# EAGLE board boron-v1.00 (EAGLE 9.1.0), part 1 of 2
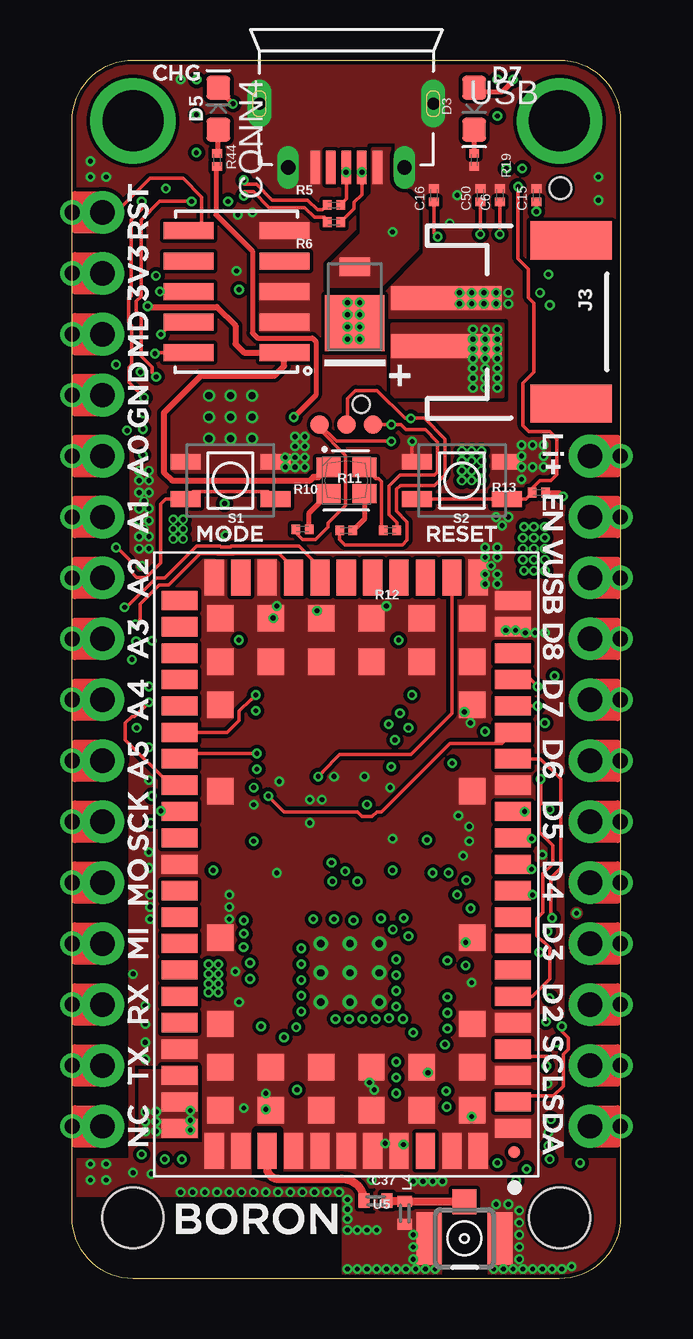
[diagram p2: board, top side]
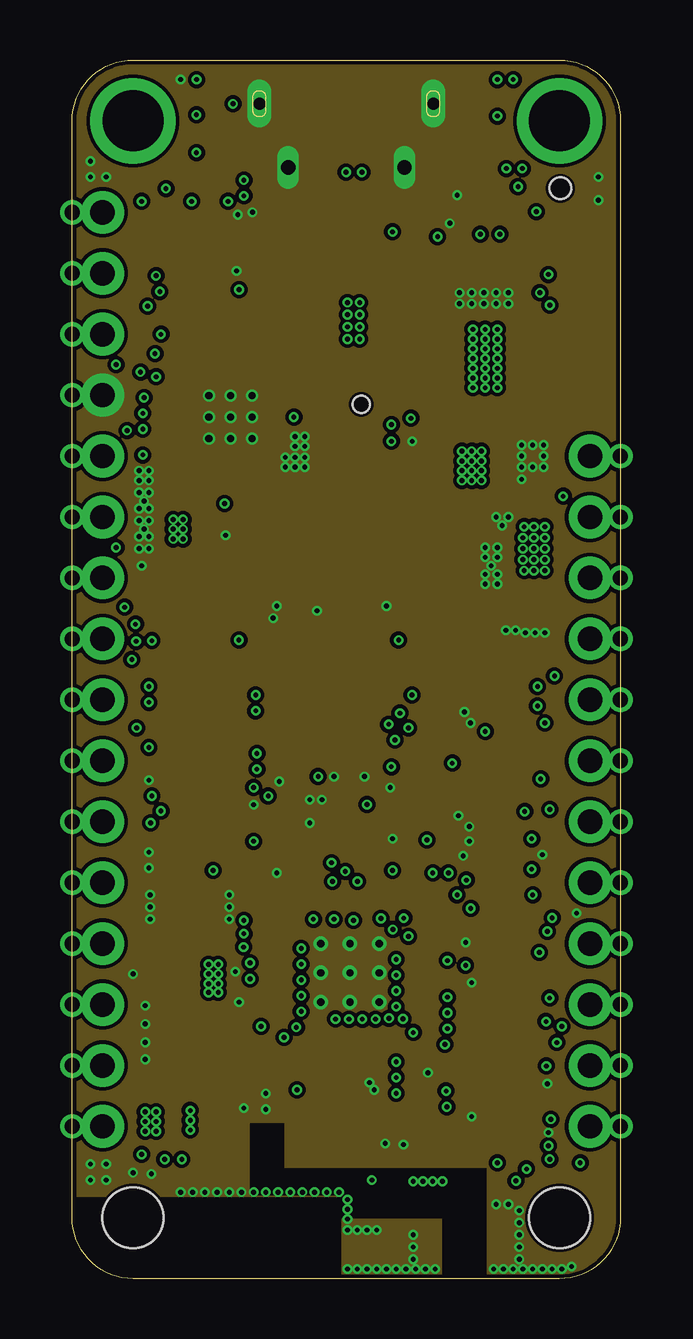
[diagram p3: board, inner layer Layer2-gnd]
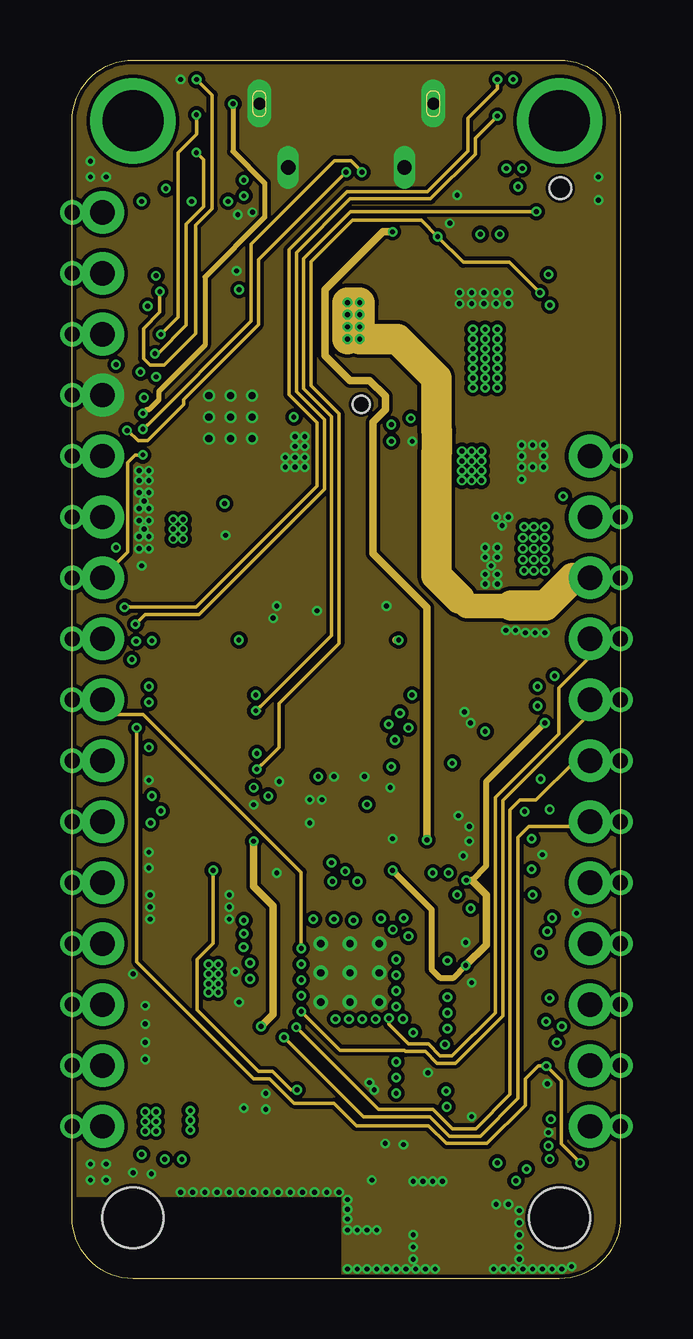
[diagram p4: board, inner layer Layer3-signal]
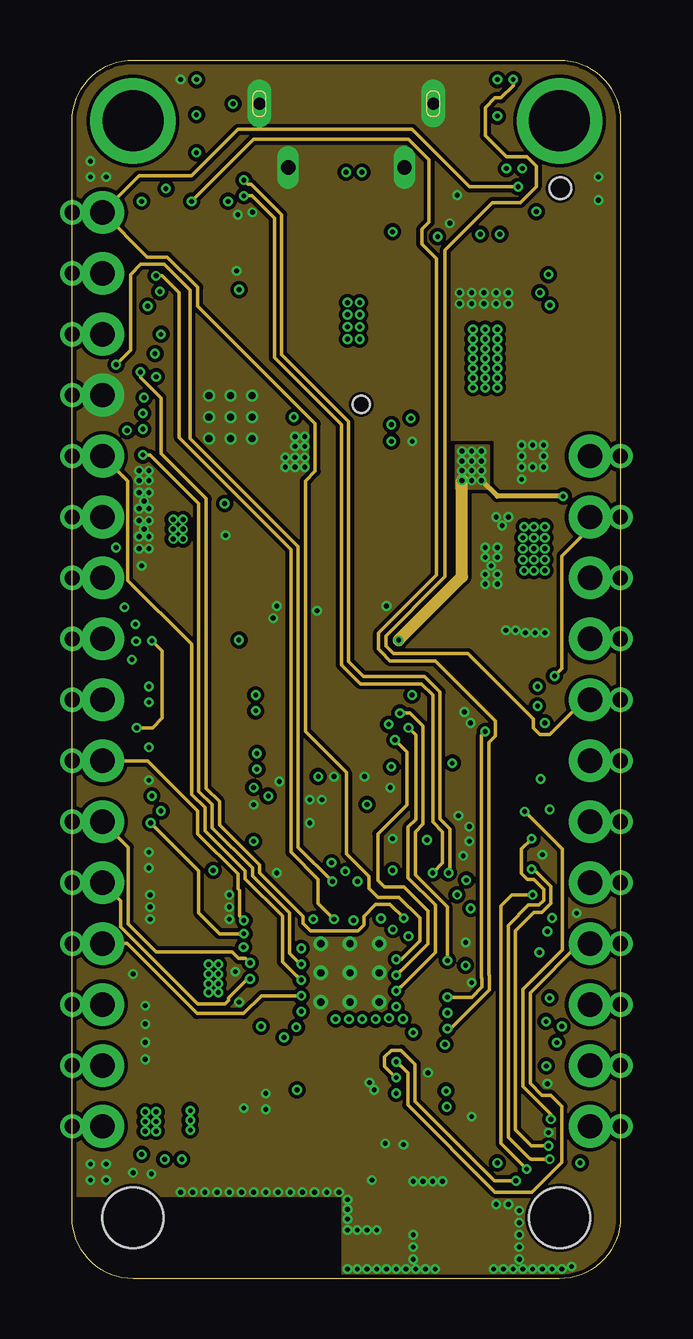
[diagram p5: board, inner layer Layer4-signal]
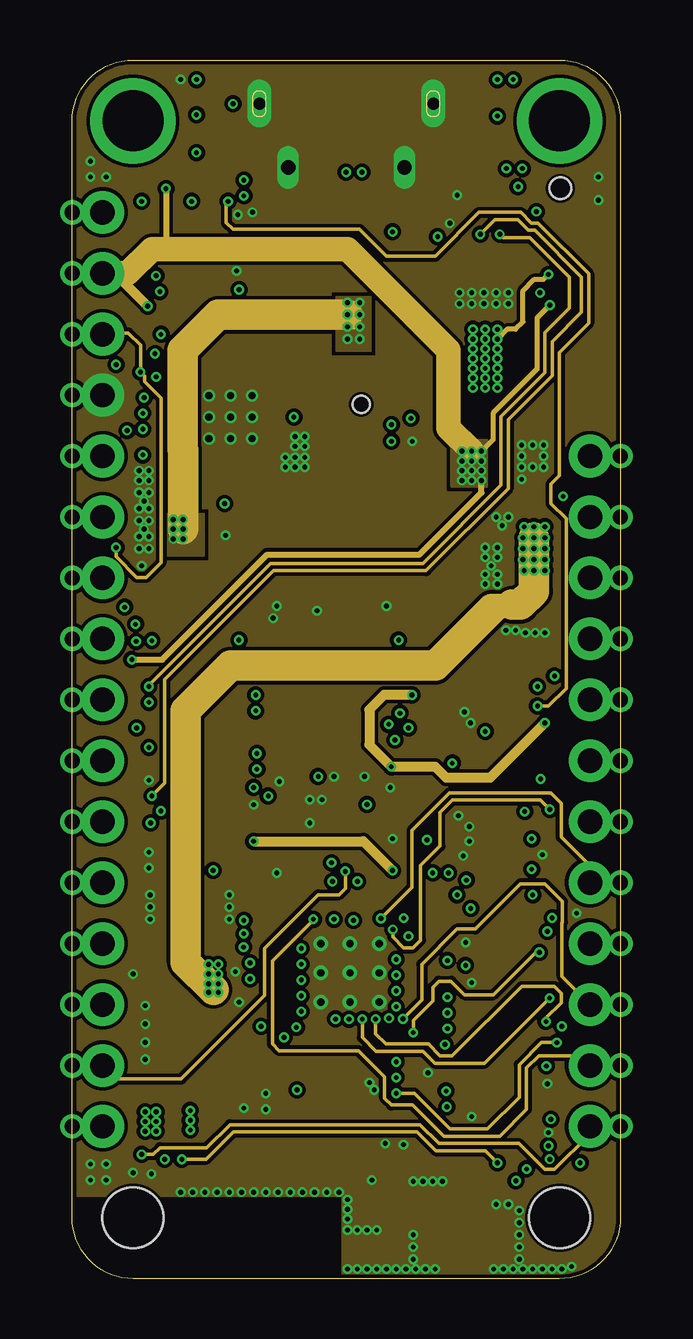
[diagram p6: board, inner layer Layer5-signal]
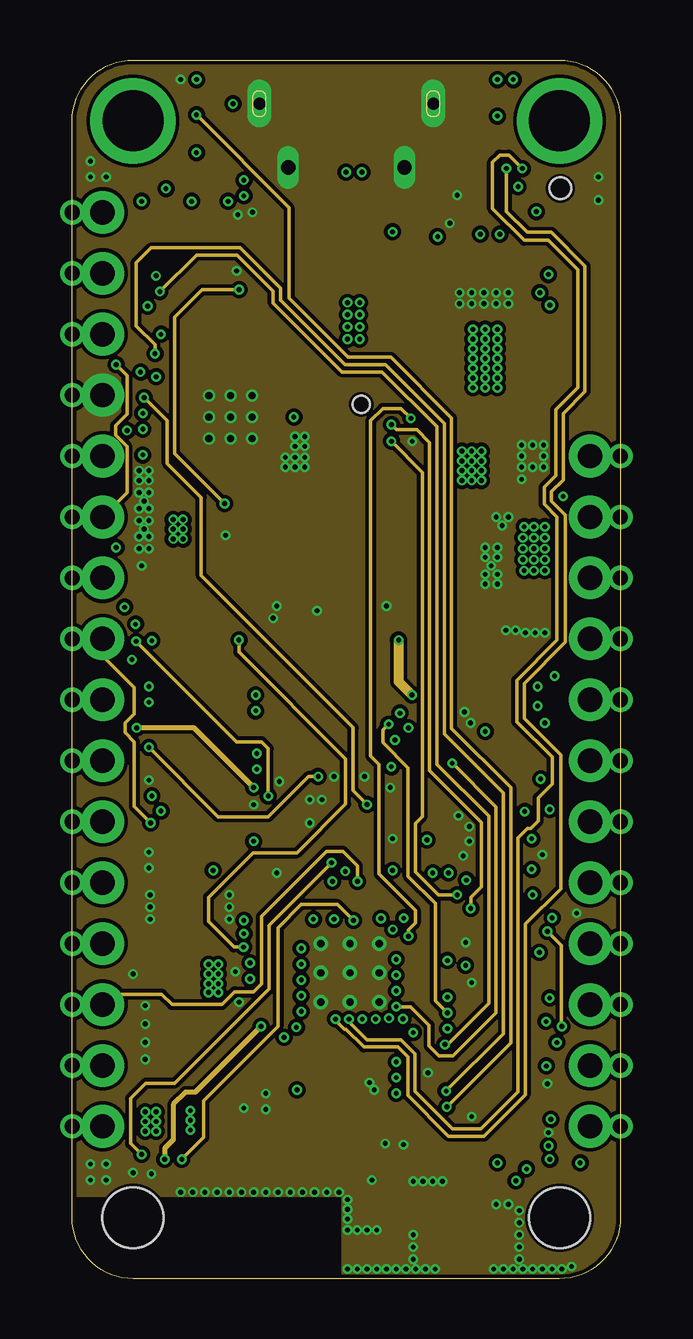
[diagram p7: board, inner layer Layer6-signal]
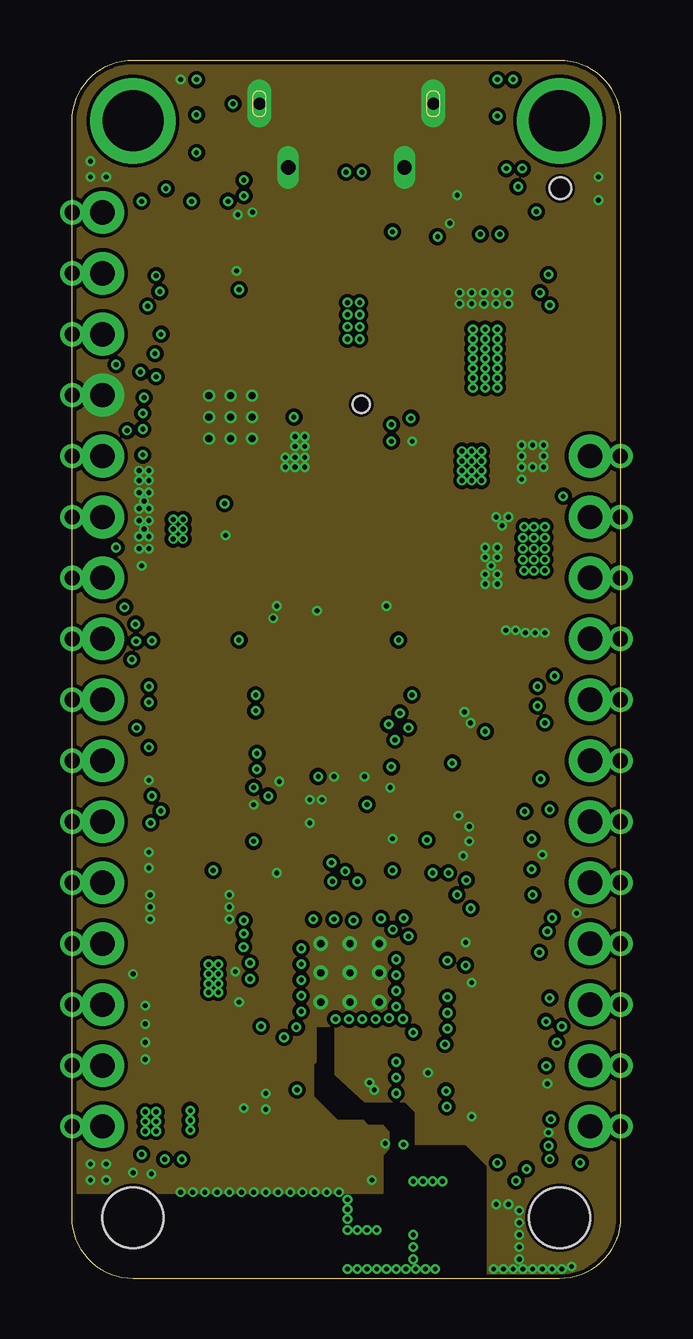
[diagram p8: board, inner layer Layer7-gnd]
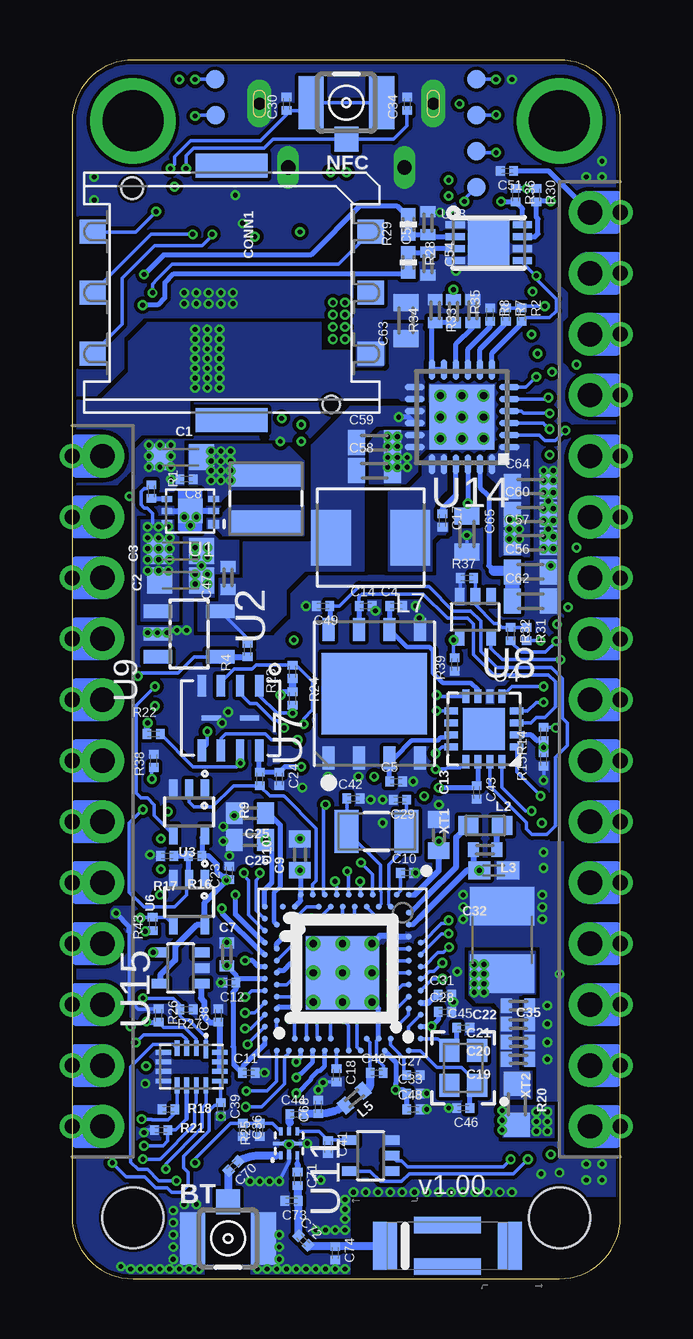
[diagram p9: board, bottom side, seen from below]

Size 22.86 x 50.8 mm. Coordinates in mm from the lower left corner, seen from the top.
Outline: 22.86,48.26 22.86,2.54 arc-90 20.32,0 2.54,0 arc-90 0,2.54 0,48.26 arc-90 2.54,50.8 20.32,50.8 arc-90 22.86,48.26
Copper layers (1+2+3+4+5+6+7+16): Top 0.018mm / dielectric 0.195mm / Layer2-gnd 0.035mm / dielectric 1.1mm / Layer3-signal 0.035mm / dielectric 0.2mm / Layer4-signal 0.035mm / dielectric 0.15mm / Layer5-signal 0.035mm / dielectric 0.2mm / Layer6-signal 0.035mm / dielectric 0.15mm / Layer7-gnd 0.035mm / dielectric 0.2mm / Bottom 0.018mm
Design rules "spark-4layer *": minimum track width 4mil, minimum drill 0.2mm, track to track 6mil, track to pad 6mil, pad to pad 6mil, via to via 6mil, smd to smd 0mil, copper to edge 6mil, drill to drill 6mil, minimum pad ring 4mil, minimum via ring 4mil, stop-mask expansion 0.01mm, vias tented up to drill 16mil, thermal gap 4mil
Net classes: 0 default: width 0.152 mm, clearance 0.152 mm; 2 RF: width 0.33 mm, clearance 0.191 mm; 3 BAT: clearance 0.203 mm; 6 +3V3: width 0.152 mm, clearance 0.152 mm
Holes 2.54 mm at 20.32,2.54 2.54,2.54
tKeepout: 5 lines
tRestrict: area 0,-0.1 to 11.2,3.4; area 15.4,0 to 17.3,2.9; area 20.7,14.9 to 21.4,15.6; 14 lines
bRestrict: area 0,-0.1 to 11.2,3.4; area 15.4,0 to 17.3,2.9; area 8.8,6.8 to 10.9,11.1; 37 lines

## Footprints (pad centres in the part's own frame; a part is rotated, then mirrored left to right if it is on the bottom)
AT5020 = smd 1 x 2: 1 2.6,0; 3 -2.6,0 | smd 2.8 x 0.7: 2 0,0.865; 4 0,-0.865
C0603K = smd 1.05 x 1.08: 1 -0.875,0; 2 0.875,0
C0201_B = smd 0.356 x 0.406: 1 -0.279,0; 2 0.279,0
C0402_B = smd 0.457 x 0.61: 1 -0.483,0; 2 0.483,0
C0402 = smd 0.7 x 0.9: 1 -0.65,0; 2 0.65,0
C0402K = smd 0.925 x 0.74: 1 -0.6,0; 2 0.6,0
C1210 = smd 1.6 x 2.7: 1 -1.4,0; 2 1.4,0
C0603_B = smd 0.711 x 1.041: 1 -0.749,0; 2 0.749,0
GCT-SIM8100 = smd 1 x 1.1: C1 2.54,-5.8; C2 0,-5.8; C3 -2.54,-5.8; C5 2.54,5.8; C6 0,5.8; C7 -2.54,5.8 | smd 1 x 3: NC@1 -5.3,0; NC@2 5.3,0 | hole 0.7: 4.65,4.15 | hole 0.9: -4.35,-4.15
1X12-CASTELLATED = drill 1.016 pad 1.778: 1 0,-13.97; 2 0,-11.43; 3 0,-8.89; 4 0,-6.35; 5 0,-3.81; 6 0,-1.27; 7 0,1.27; 8 0,3.81; 9 0,6.35; 10 0,8.89; 11 0,11.43; 12 0,13.97 | drill 0.635 pad 1.016: @1 1.27,-13.97; @2 1.27,-11.43; @3 1.27,-8.89; @4 1.27,-6.35; @5 1.27,-3.81; @6 1.27,-1.27; @7 1.27,1.27; @8 1.27,3.81; @9 1.27,6.35; @10 1.27,8.89; @11 1.27,11.43; @12 1.27,13.97
CONN5X2_1.27 = smd 0.7 x 2.1: 1 -2.54,-2; 2 -2.54,2; 3 -1.27,-2; 4 -1.27,2; 5 0,-2; 6 0,2; 7 1.27,-2; 8 1.27,2; 9 2.54,-2; 10 2.54,2
1X16-CASTELLATED = drill 1.016 pad 1.778: 1 0,-19.05; 2 0,-16.51; 3 0,-13.97; 4 0,-11.43; 5 0,-8.89; 6 0,-6.35; 7 0,-3.81; 8 0,-1.27; 9 0,1.27; 10 0,3.81; 11 0,6.35; 12 0,8.89; 13 0,11.43; 14 0,13.97; 15 0,16.51; 16 0,19.05 | drill 0.635 pad 1.016: @1 1.27,-19.05; @2 1.27,-16.51; @3 1.27,-13.97; @4 1.27,-11.43; @5 1.27,-8.89; @6 1.27,-6.35; @7 1.27,-3.81; @8 1.27,-1.27; @9 1.27,1.27; @10 1.27,3.81; @11 1.27,6.35; @12 1.27,8.89; @13 1.27,11.43; @14 1.27,13.97; @15 1.27,16.51; @16 1.27,19.05
LED-0603 = smd 1 x 1: A -0.877,0; C 0.877,0
DIODE-DO-220AA_NT(SMP) = smd 0.762 x 1.27: ANODE 2.349,0 | smd 2.337 x 2.464: CATHODE 0,0
JST-2-SMD@2 = smd 1 x 4.6: 1 -1,-3.7; 2 1,-3.7 | smd 1.6 x 3.4: NC1 -3.4,1.5; NC2 3.4,1.5
INDUCTOR-VLS-E = smd 1 x 3: P$1 -1,0; P$2 1,0
RESC0603_L = smd 0.85 x 0.8: 1 -0.7,0; 2 0.7,0
INDUCTOR-4040 = smd 1.65 x 2.3: P$1 -1.65,0; P$2 1.65,0
R0603 = smd 1 x 1.1: 1 -0.85,0; 2 0.85,0
0402-RES = smd 0.55 x 0.6: 1 -0.4,0; 2 0.4,0
R0402_B = smd 0.457 x 0.61: 1 -0.483,0; 2 0.483,0
TACTILE_SWITCH_SMD = smd 1.25 x 0.65: 1 -1.875,0.775; 2 1.875,0.775; 3 -1.875,-0.775; 4 1.875,-0.775
USP-6C = smd 0.45 x 0.35: 1 -0.975,0.55 | smd 0.45 x 0.25: 2 -0.975,0; 3 -0.975,-0.5; 4 0.975,-0.5; 5 0.975,0; 6 0.975,0.5 | smd 1.016 x 1.016: P$1 0,0
SOT25 = smd 0.55 x 1.2: 1 -0.95,-1.3; 2 0,-1.3; 3 0.95,-1.3; 4 0.95,1.3; 5 -0.95,1.3
SC-70-5 = smd 0.35 x 0.8: 1 -0.65,-0.95; 2 0,-0.95; 3 0.65,-0.95; 4 0.65,0.95; 5 -0.65,0.95
MLP16 = smd 0.57 x 0.3: 1 -1.365,0.75; 2 -1.365,0.25; 3 -1.365,-0.25; 4 -1.365,-0.75; 9 1.365,-0.75; 10 1.365,-0.25; 11 1.365,0.25; 12 1.365,0.75 | smd 0.3 x 0.57: 5 -0.75,-1.365; 6 -0.25,-1.365; 7 0.25,-1.365; 8 0.75,-1.365; 13 0.75,1.365; 14 0.25,1.365; 15 -0.25,1.365; 16 -0.75,1.365 | smd 1.75 x 1.75: P$1 0,0
U-BLOX-SARA-U2 = smd 1.5 x 0.8: 1 -6.95,11; 2 -6.95,9.9; 3 -6.95,8.8; 4 -6.95,7.7; 5 -6.95,6.6; 6 -6.95,5.5; 7 -6.95,4.4; 8 -6.95,3.3; 9 -6.95,2.2; 10 -6.95,1.1; 11 -6.95,0; 12 -6.95,-1.1; 13 -6.95,-2.2; 14 -6.95,-3.3; 15 -6.95,-4.4; 16 -6.95,-5.5; 17 -6.95,-6.6; 18 -6.95,-7.7; 19 -6.95,-8.8; 20 -6.95,-9.9; 21 -6.95,-11; 33 6.95,-11; 34 6.95,-9.9; 35 6.95,-8.8; 36 6.95,-7.7; 37 6.95,-6.6; 38 6.95,-5.5; 39 6.95,-4.4; 40 6.95,-3.3; 41 6.95,-2.2; 42 6.95,-1.1; 43 6.95,0; 44 6.95,1.1; 45 6.95,2.2; 46 6.95,3.3; 47 6.95,4.4; 48 6.95,5.5; 49 6.95,6.6; 50 6.95,7.7; 51 6.95,8.8; 52 6.95,9.9; 53 6.95,11 | smd 0.8 x 1.5: 22 -5.5,-11.95; 23 -4.4,-11.95; 24 -3.3,-11.95; 25 -2.2,-11.95; 26 -1.1,-11.95; 27 0,-11.95; 28 1.1,-11.95; 29 2.2,-11.95; 30 3.3,-11.95; 31 4.4,-11.95; 32 5.5,-11.95; 54 5.5,11.95; 55 4.4,11.95; 56 3.3,11.95; 57 2.2,11.95; 58 1.1,11.95; 59 0,11.95; 60 -1.1,11.95; 61 -2.2,11.95; 62 -3.3,11.95; 63 -4.4,11.95; 64 -5.5,11.95 | smd 1.1 x 1.1: 65 -5.25,10.25; 66 -3.15,10.25; 67 -1.05,10.25; 68 1.05,10.25; 69 3.15,10.25; 70 5.25,10.25; 71 -5.25,8.45; 72 -3.15,8.45; 73 -1.05,8.45; 74 1.05,8.45; 75 3.15,8.45; 76 5.25,8.45; 77 -5.25,6.65; 78 5.25,6.65; 79 -5.25,3.05; 80 5.25,3.05; 81 -5.25,-3.05; 82 5.25,-3.05; 83 -5.25,-6.65; 84 5.25,-6.65; 85 -5.25,-8.45; 86 -3.15,-8.45; 87 -1.05,-8.45; 88 1.05,-8.45; 89 3.15,-8.45; 90 5.25,-8.45; 91 -5.25,-10.25; 92 -3.15,-10.25; 93 -1.05,-10.25; 94 1.05,-10.25; 95 3.15,-10.25; 96 5.25,-10.25 | smd 0.5 x 0.5: FID_PIN1 -7,12
MFF2 = smd 0.96 x 0.5: 1 -2.675,1.905; 2 -2.675,0.635; 3 -2.675,-0.635; 4 -2.675,-1.905; 5 2.675,-1.905; 6 2.675,-0.635; 7 2.675,0.635; 8 2.675,1.905 | smd 3.4 x 4.4: P$1 0,0
SC70-5 = smd 0.4 x 0.7: 1 -0.65,-0.85; 2 0,-0.85; 3 0.65,-0.85; 4 0.65,0.85; 5 -0.65,0.85
USON8-3X4 = smd 0.9 x 0.35: 1 -1.35,1.2; 2 -1.35,0.4; 3 -1.35,-0.4; 4 -1.35,-1.2; 5 1.35,-1.2; 6 1.35,-0.4; 7 1.35,0.4; 8 1.35,1.2 | smd 0.2 x 0.8: 9 0,0.8; 10 0,-0.8
AQFN50P700X700X85_HS-74N = smd 3.048 x 3.048: P$74 0,0 | drill 0.3 pad 0.6: P$75 -1.219,1.219; P$76 0,1.219; P$77 1.219,1.219; P$78 -1.219,0; P$79 0,0; P$80 1.219,0; P$81 -1.219,-1.219; P$82 0,-1.219; P$83 1.219,-1.219 | smd 0.25 x 0.25: P$A8 -1.25,3.25; P$A10 -0.75,3.25; P$A12 -0.25,3.25; P$A14 0.25,3.25; P$A16 0.75,3.25; P$A18 1.25,3.25; P$A20 1.75,3.25; P$A22 2.25,3.25; P$A23 2.75,3.25; P$AA24 3.25,-2.25; P$AB2 -2.75,-2.5; P$AC5 -2,-2.75; P$AC9 -1,-2.75; P$AC11 -0.5,-2.75; P$AC13 0,-2.75; P$AC15 0.5,-2.75; P$AC17 1,-2.75; P$AC19 1.5,-2.75; P$AC21 2,-2.75; P$AC24 3.25,-2.75; P$AD2 -2.75,-3.25; P$AD4 -2.25,-3.25; P$AD6 -1.75,-3.25; P$AD8 -1.25,-3.25; P$AD10 -0.75,-3.25; P$AD12 -0.25,-3.25; P$AD14 0.25,-3.25; P$AD16 0.75,-3.25; P$AD18 1.25,-3.25; P$AD20 1.75,-3.25; P$AD22 2.25,-3.25; P$AD23 2.75,-3.25; P$B1 -3.25,2.75; P$B3 -2.5,2.75; P$B5 -2,2.75; P$B7 -1.5,2.75; P$B9 -1,2.75; P$B11 -0.5,2.75; P$B13 0,2.75; P$B15 0.5,2.75; P$B17 1,2.75; P$B19 1.5,2.75; P$B24 3.25,2.75; P$C1 -3.25,2.25; P$D2 -2.75,2; P$D23 2.75,2; P$E24 3.25,1.75; P$F2 -2.75,1.5; P$F23 2.75,1.5; P$G1 -3.25,1.25; P$H2 -2.75,1; P$H23 2.75,1; P$J1 -3.25,0.75; P$J24 3.25,0.75; P$K2 -2.75,0.5; P$L1 -3.25,0.25; P$L24 3.25,0.25; P$M2 -2.75,0; P$N1 -3.25,-0.25; P$N24 3.25,-0.25; P$P2 -2.75,-0.5; P$P23 2.75,-0.5; P$R1 -3.25,-0.75; P$R24 3.25,-0.75; P$T2 -2.75,-1; P$T23 2.75,-1; P$U1 -3.25,-1.25; P$U24 3.25,-1.25; P$V23 2.75,-1.5; P$W1 -3.25,-1.75; P$W24 3.25,-1.75; P$Y2 -2.75,-2; P$Y23 2.75,-2
UFQFN-16 = smd 0.2 x 0.75: 1 -0.6,-0.73 | smd 0.2 x 0.65: 2 -0.2,-0.78; 3 0.2,-0.78; 4 0.6,-0.78; 9 0.6,0.78; 10 0.2,0.78; 11 -0.2,0.78; 12 -0.6,0.78 | smd 0.65 x 0.2: 5 1.18,-0.6; 6 1.18,-0.2; 7 1.18,0.2; 8 1.18,0.6; 13 -1.18,0.6; 14 -1.18,0.2; 15 -1.18,-0.2; 16 -1.18,-0.6
TDFN-8 = smd 0.8 x 0.3: 1 -1.4,0.75; 2 -1.4,0.25; 3 -1.4,-0.25; 4 -1.4,-0.75; 5 1.4,-0.75; 6 1.4,-0.25; 7 1.4,0.25; 8 1.4,0.75 | smd 1.73 x 1.88: EP 0,0
QFN24 = smd 0.85 x 0.28: 1 -1.975,1.25; 2 -1.975,0.75; 3 -1.975,0.25; 4 -1.975,-0.25; 5 -1.975,-0.75; 6 -1.975,-1.25; 13 1.975,-1.25; 14 1.975,-0.75; 15 1.975,-0.25; 16 1.975,0.25; 17 1.975,0.75; 18 1.975,1.25 | smd 0.28 x 0.85: 7 -1.25,-1.975; 8 -0.75,-1.975; 9 -0.25,-1.975; 10 0.25,-1.975; 11 0.75,-1.975; 12 1.25,-1.975; 19 1.25,1.975; 20 0.75,1.975; 21 0.25,1.975; 22 -0.25,1.975; 23 -0.75,1.975; 24 -1.25,1.975 | smd 2.7 x 2.7: PAD 0,0 | drill 0.3 pad 0.406: PAD@1 -0.9,0.9; PAD@2 0,0.9; PAD@3 0.9,0.9; PAD@4 -0.9,0; PAD@5 0,0; PAD@6 0.9,0; PAD@7 -0.9,-0.9; PAD@8 0,-0.9; PAD@9 0.9,-0.9
TP30_TOP = smd 0.762 x 0.762: P$1 0,0
PLCC4-2MM-RGB = smd 1 x 0.8: BLUE -0.75,-0.55; CA 0.75,-0.55; GREEN -0.75,0.55; RED 0.75,0.55
MLPD-6-1X1 = smd 0.33 x 0.15: P$1 -0.5,0.35; P$3 -0.5,-0.35; P$4 0.5,-0.35; P$5 0.5,0; P$6 0.5,0.35 | smd 0.45 x 0.15: P$2 -0.44,0 | smd 0.15 x 0.45: P$7 0,-0.43; P$8 0,0.43
MICRO_USB = smd 0.4 x 1.4: 1 1.3,0.1; 2 0.65,0.1; 3 0,0.1; 4 -0.65,0.1; 5 -1.3,0.1 | drill 0.6 pad 0.75 long: 6 2.425,0.1 | drill 0.5 pad 1 long: 7 3.625,2.75; 8 -3.625,2.75 | drill 0.6 pad 0.65 long: 9 -2.425,0.1
IPEX-20279-001E = smd 1 x 1.05: 1 0,1.528 | smd 1.05 x 2.2: 2@1 -1.475,0; 2@2 1.475,0
XTAL_3215_N = smd 1 x 1.8: 1 -1.25,0; 2 1.25,0
BT-XTAL_2016_N = smd 0.95 x 0.85: 1 -0.725,-0.575; 2 0.725,-0.575; 3 0.725,0.575; 4 -0.725,0.575

## Placement (x,y rotation side)
ANT1  AT5020  [AT5020]  7.21,1.37 180 bottom
C1  10uF/10V  [C0603K]  18.34,34.24 180 bottom
C2  10uF/10V  [C0603K]  18.34,29.11 0 bottom
C3  100nF  [C0603K]  18.34,30.33 0 bottom
C4  47pF  [C0201_B]  9.35,28.04 0 bottom
C5  47pF  [C0201_B]  9.35,20.73 0 bottom
C6  47pF  [C0201_B]  17.83,45.16 90 top
C7  0.1uF  [C0402_B]  16.41,13.51 90 bottom
C8  100nF  [C0201_B]  18.08,33.32 180 bottom
C9  4.7uF  [C0402]  13.36,17.68 90 bottom
C10  100nF  [C0201_B]  8.89,16.92 0 bottom
C11  100nF  [C0201_B]  15.49,8.59 0 bottom
C12  100nF  [C0201_B]  16.31,12.34 180 bottom
C13  1uF  [C0402]  7.57,18.49 90 bottom
C14  47pF  [C0201_B]  10.62,28.04 0 bottom
C15  47pF  [C0201_B]  19.35,45.16 90 top
C16  47pF  [C0201_B]  15.09,45.16 90 top
C17  47nF  [C0201_B]  7.42,31.6 270 bottom
C18  820pF  [C0201_B]  11.84,8.48 270 bottom
C19  0.1uF  [C0402_B]  4.27,9.14 0 bottom
C20  10nF  [C0402_B]  4.27,9.86 0 bottom
C21  68pF  [C0402_B]  4.27,10.62 0 bottom
C22  15pF  [C0402_B]  4.27,11.38 0 bottom
C23  100nF  [C0201_B]  16.31,16.92 90 bottom
C24  100nF  [C0201_B]  14.22,20.83 270 bottom
C25  4.7uF  [C0402]  15.44,19.41 180 bottom
C26  4.7uF  [C0402]  15.44,18.29 180 bottom
C27  100pF  [C0201_B]  8.64,8.48 0 bottom
C28  100nF  [C0201_B]  7.32,11.13 0 bottom
C29  12pF  [C0201_B]  9.19,19.96 180 bottom
C30  DNP  [C0201_B]  13.92,48.97 90 bottom
C31  NC  [C0201_B]  7.32,11.84 0 bottom
C32  1uF  [C0402K]  5.28,17.02 0 bottom
C33  NC  [C0201_B]  8.64,7.72 0 bottom
C34  DNP  [C0201_B]  8.89,48.97 90 bottom
C35  220uF  [C1210]  4.93,14.12 90 bottom
C36  33pF  [C0201_B]  15.75,6.2 270 bottom
C37  15pF (Murata GRM1555C1H150JA01)  [C0402_B]  12.65,3.25 0 top
C38  100nF  [C0201_B]  16.76,10.97 90 bottom
C39  100nF  [C0201_B]  16.66,7.06 270 bottom
C40  0.8pF  [C0201_B]  10.16,8.59 0 bottom
C41  33pF  [C0201_B]  12.19,5.49 270 bottom
C42  12pF  [C0201_B]  11.13,20.02 0 bottom
C43  100nF  [C0201_B]  5.99,20.27 270 bottom
C44  10pF  [C0201_B]  13.51,6.86 0 bottom
C45  12pF  [C0201_B]  6.55,10.46 0 bottom
C46  12pF  [C0201_B]  6.55,7.11 180 bottom
C47  1nF/10V  [C0402_B]  16.36,29.21 90 bottom
C48  47nF  [C0201_B]  8.64,7.06 0 bottom
C49  100nF  [C0201_B]  12.4,28.04 180 bottom
C50  100nF  [C0201_B]  17.02,45.16 90 top
C51  100nF  [C0201_B]  4.72,46.18 180 bottom
C54  10nF  [C0402_B]  8.03,42.32 270 bottom
C55  1uF  [C0402_B]  8.03,43.99 90 bottom
C56  10uF,25V,X5R  [C0603_B]  3.76,29.46 0 bottom
C57  10uF,25V,X5R  [C0603_B]  3.76,30.68 0 bottom
C58  10uF  [C0603_B]  10.26,33.68 0 bottom
C59  10uF  [C0603_B]  10.26,34.85 0 bottom
C60  1uF,25V,X5R  [C0603_B]  3.76,31.85 0 bottom
C62  10uF,25V,X5R  [C0603_B]  3.76,28.24 0 bottom
C63  10uF  [C0603_B]  8.94,39.93 90 bottom
C64  10uF,25V,X5R  [C0603_B]  3.76,33.02 0 bottom
C65  4.7uF  [C0603_B]  6.4,31.04 270 bottom
C68  0.5pF  [C0201_B]  12.6,7.16 90 bottom
C70  10pF  [C0201_B]  16.14,4.69 225 bottom
C71  0R JUMPER  [C0201_B]  13.46,4.17 270 bottom
C72  2.7pF  [C0201_B]  13.22,1.59 315 bottom
C73  DNP  [C0201_B]  13.72,3.25 180 bottom
C74  3.9nH  [C0201_B]  11.89,1.07 270 bottom
CONN1  SIM-NANO-4FF  [GCT-SIM8100]  16.21,41.1 270 bottom
CONN2  M12PTH-CST-R  [1X12-CASTELLATED]  21.59,20.32 180 bottom
CONN4  CONN5X2  [CONN5X2_1.27]  6.86,41.15 90 top
CONN6  M16PTH-CST-R  [1X16-CASTELLATED]  1.27,25.4 0 bottom
D3  P1.03  [LED-0603]  16.76,48.77 270 top
D4  DIODE_NT  [DIODE-DO-220AA_NT(SMP)]  11.79,39.83 90 top
D5  P1.03  [LED-0603]  6.1,48.77 90 top
J3  [JST-2-SMD@2]  19.3,39.88 270 top
L1  [INDUCTOR-VLS-E]  14.78,32.51 90 bottom
L2  10uH  [RESC0603_L]  5.64,18.9 0 bottom
L3  15nH  [C0402_B]  5.64,17.88 180 bottom
L4  MURATA LQG15HN39NJ02  [C0402_B]  13.87,2.74 270 top
L5  3.3nH  [C0402_B]  11.09,7.53 220 bottom
L7  2.2uH  [INDUCTOR-4040]  10.41,30.89 180 bottom
R1  10K  [C0201_B]  19.56,32.82 270 bottom
R2  10K  [C0201_B]  4.11,40.18 270 bottom
R4  100K  [C0201_B]  15.54,26.21 90 bottom
R5  33R  [C0201_B]  10.92,44.75 180 top
R6  33R  [C0201_B]  10.92,44.04 180 top
R7  10K  [C0201_B]  4.78,40.18 270 bottom
R8  10K  [C0201_B]  5.44,40.18 270 bottom
R9  10K  [C0201_B]  15.04,20.83 90 bottom
R10  1K  [C0201_B]  9.6,31.24 0 top
R11  1K  [C0201_B]  11.43,31.19 0 top
R12  1K  [C0201_B]  13.26,31.19 180 top
R13  10K  [C0201_B]  19.46,32.77 180 top
R14  10K  [C0201_B]  3.2,22.71 90 bottom
R15  DNP  [C0201_B]  3.2,21.64 90 bottom
R16  10K  [C0201_B]  17.73,17.63 0 bottom
R17  DNP  [C0201_B]  18.9,17.63 0 bottom
R18  10K  [C0201_B]  18.85,7.06 0 bottom
R19  1K  [C0201_B]  16.76,46.63 90 top
R20  BLM18EG221  [R0603]  4.32,7.26 90 bottom
R21  10K  [C0201_B]  19.15,6.2 0 bottom
R22  10K  [C0201_B]  19.46,22.71 0 bottom
R23  10K  [C0201_B]  13.67,25.3 90 bottom
R24  100K  [C0201_B]  13.67,24.18 270 bottom
R25  10K  [C0201_B]  15.04,6.2 90 bottom
R26  10K  [C0201_B]  19.25,10.97 270 bottom
R27  10K  [C0201_B]  18.08,11.23 180 bottom
R28  150  [0402-RES]  8.84,42.37 270 bottom
R29  1K  [0402-RES]  8.84,43.94 90 bottom
R30  4K7  [C0201_B]  3.51,45.16 270 bottom
R31  0R  [C0201_B]  3.91,26.87 270 bottom
R32  DNP  [C0201_B]  4.57,26.87 270 bottom
R33  333R  [R0402_B]  6.15,40.34 90 bottom
R34  10K  [R0402_B]  7.72,40.34 90 bottom
R35  5.6K  [R0402_B]  6.96,40.34 270 bottom
R36  4K7  [C0201_B]  4.37,45.16 270 bottom
R37  10K  [C0201_B]  6.4,29.21 0 bottom
R38  10K  [C0201_B]  19.46,21.59 90 bottom
R39  10K  [C0201_B]  6.91,25.6 90 bottom
R43  10K  [C0201_B]  19.51,14.78 90 bottom
R44  1K  [C0201_B]  6.05,46.63 270 top
S1  [TACTILE_SWITCH_SMD]  6.6,33.27 0 top
S2  [TACTILE_SWITCH_SMD]  16.26,33.27 0 top
U1  XC9258A33EER-G  [USP-6C]  17.93,32 180 bottom
U2  XC8107SOT25  [SOT25]  17.98,26.87 270 bottom
U3  SN74LVC1G07  [SC-70-5]  17.98,19.46 180 bottom
U4  FSA2567MPXMLP  [MLP16]  5.69,22.91 180 bottom
U5  U-BLOX-SARA-R4  [U-BLOX-SARA-U2]  11.43,17.27 180 top
U6  SN74LVC1G07  [SC-70-5]  17.98,15.7 180 bottom
U7  ESIMSON8  [MFF2]  10.26,24.38 90 bottom
U8  SN74LV1T34  [SC70-5]  6.05,27.58 180 bottom
U9  FLASH-SPIUSON-8L-4X3  [USON8-3X4]  16.26,23.37 270 bottom
U10  NRF52840  [AQFN50P700X700X85_HS-74N]  11.58,12.75 270 bottom
U11  SN74LVC1G04  [SC70-5]  10.41,5.13 90 bottom
U12  SN74AVC4T774  [UFQFN-16]  17.88,8.84 180 bottom
U13  MAX1704X  [TDFN-8]  5.49,43.18 0 bottom
U14  BQ24195L  [QFN24]  6.6,35.92 180 bottom
U15  TPS22942DCKRSMALL  [SC70-5]  18.34,12.95 90 bottom
U$1  TP5  [TP30_TOP]  6,47 0 bottom
U$4  TP5  [TP30_TOP]  6,48.5 0 bottom
U$5  TP5  [TP30_TOP]  6,50 0 bottom
U$6  RGB-LED-CLMVB-FKARGB  [PLCC4-2MM-RGB]  11.43,33.27 180 top
U$7  SKY13351-378LF  [MLPD-6-1X1]  13.82,5.64 90 bottom
U$9  TP5  [TP30_TOP]  10.31,35.61 270 top
U$10  TP5  [TP30_TOP]  11.43,35.61 270 top
U$11  TP5  [TP30_TOP]  12.55,35.61 270 top
U$18  TP5  [TP30_TOP]  16.88,48.5 0 bottom
U$19  TP5  [TP30_TOP]  16.9,50 0 bottom
U$20  TP5  [TP30_TOP]  6,45.5 0 bottom
USB  MICRO_USB_5P  [MICRO_USB]  11.43,46.23 0 top
X3  IPEX-20279-001E  [IPEX-20279-001E]  16.36,1.68 0 top
X4  IPEX-20279-001E  [IPEX-20279-001E]  16.36,1.68 0 bottom
X5  IPEX-20279-001E  [IPEX-20279-001E]  11.43,49.02 180 bottom
XT1  32.768kHz  [XTAL_3215_N]  10.16,18.64 0 bottom
XT2  [BT-XTAL_2016_N]  6.55,8.79 90 bottom